# Altium schematic sheet T-FC10W-M.SchDoc
size A4; PageSetup: Record=PageOptions|CenterHorizontal=True|CenterVertical=True|PrintScale=0.97|XCorrection=1.00|YCorrection=1.00|PrintKind=0|BorderSize=5000000|LeftOffset=0|BottomOffset=0|Orientation=2|PaperLength=1000|PaperWidth=1000|Scale=100|PaperSource=7|PrintQuality=-3|MediaType=1|DitherType=10|PrintScaleMode=1|PaperKind=A4|PaperIndex=9
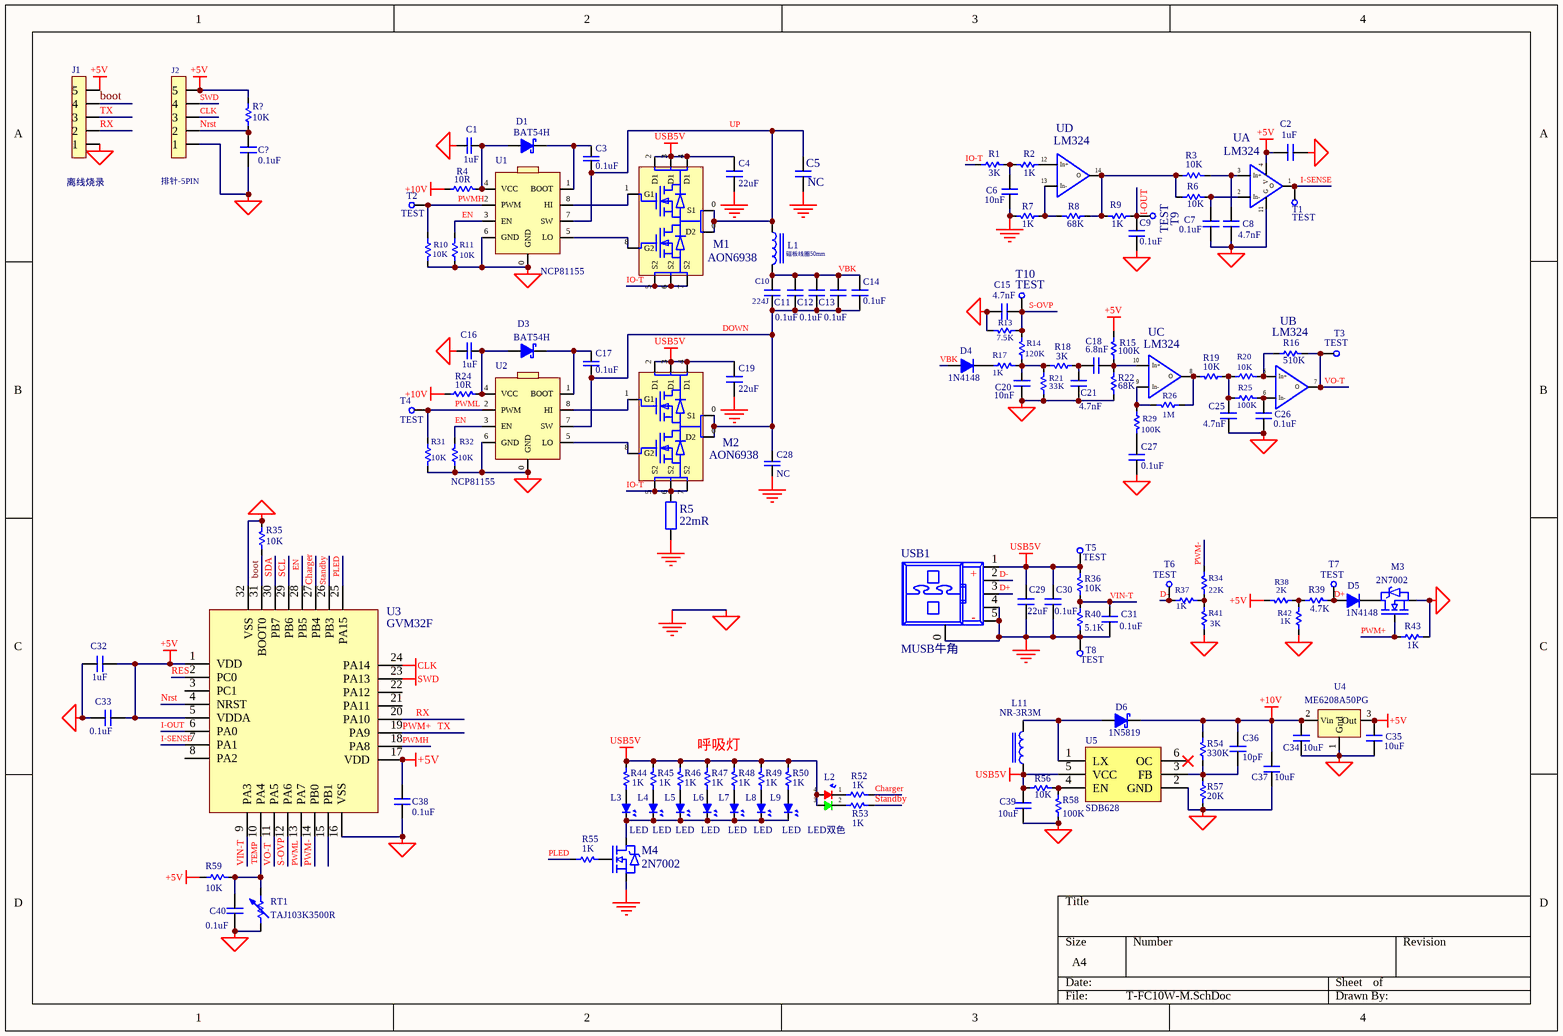
[diagram p0: T-FC10W-M.SchDoc]

## Parts
C1  C0603  [0603]  (value not drawn)
C2  1uF  [0603]
C3  C0603  [0603]  (value not drawn)
C4  22uF  [1206]
C5  NC  [0603]
C6  10nF  [0603]
C7  0.1uF  [0603]
C8  4.7nF  [0603]
C9  0.1uF  [0603]
C10  224J  [薄膜电容A]
C11  0.1uF  [1206]
C12  0.1uF  [1206]
C13  0.1uF  [1206]
C14  0.1uF  [1206]
C15  4.7nF  [0603]
C16  C0603  [0603]  (value not drawn)
C17  C0603  [0603]  (value not drawn)
C18  6.8nF  [0603]
C19  22uF  [1206]
C20  10nF  [0603]
C21  4.7nF  [0603]
C25  4.7nF  [0603]
C26  0.1uF  [0603]
C27  0.1uF  [0603]
C28  C0603  [0603]  (value not drawn)
C29  22uF  [1206]
C30  0.1uF  [0603]
C31  0.1uF  [0603]
C32  1uF  [0603]
C33  0.1uF  [0603]
C34  10uF  [0805]
C35  10uF  [0805]
C36  10pF  [0603]
C37  10uF  [0805]
C38  0.1uF  [0603]
C39  10uF  [0805]
C40  0.1uF  [0603]
C?  0.1uF  [0603]
D1  SOD-323  [SOD-323]  (value not drawn)
D3  SOD-323  [SOD-323]  (value not drawn)
D4  1N4148  [SOD-323]
D5  1N4148  [SOD-323]
D6  1N5819  [SOD-123]
J1  离线烧录  [5PIN排针1.25mm]
J2  排针-5PIN  [5PIN排针1.25mm]
L1  无线磁板线圈50mm  [磁板线圈50mm]  (value not drawn)
L2  LED双色  [LED0603双色]
L3  LED  [LED0802]
L4  LED  [LED0802]
L5  LED  [LED0802]
L6  LED  [LED0802]
L7  LED  [LED0802]
L8  LED  [LED0802]
L9  LED  [LED0802]
L11  NR-3R3M  [L3015T]
M1  AON6938  [QFN-5*6]
M2  AON6938  [QFN-5*6]
M3  2N7002  [SOT-23-L]
M4  2N7002  [SOT-23-L]
R1  3K  [0603]
R2  1K  [0603]
R3  10K  [0603]
R4  R0603  [0603]  (value not drawn)
R5  22mR  [1206]
R6  10K  [0603]
R7  1K  [0603]
R8  68K  [0603]
R9  1K  [0603]
R10  10K  [0603]
R11  10K  [0603]
R13  7.5K  [0603]
R14  120K  [0603]
R15  100K  [0603]
R16  510K  [0603]
R17  1K  [0603]
R18  3K  [0603]
R19  10K  [0603]
R20  10K  [0603]
R21  33K  [0603]
R22  68K  [0603]
R24  R0603  [0603]  (value not drawn)
R25  100K  [0603]
R26  1M  [0603]
R29  100K  [0603]
R31  10K  [0603]
R32  10K  [0603]
R34  22K  [0603]
R35  10K  [0603]
R36  10K  [0603]
R37  1K  [0603]
R38  2K  [0603]
R39  4.7K  [0603]
R40  5.1K  [0603]
R41  3K  [0603]
R42  1K  [0603]
R43  1K  [0603]
R44  1K  [0603]
R45  1K  [0603]
R46  1K  [0603]
R47  1K  [0603]
R48  1K  [0603]
R49  1K  [0603]
R50  1K  [0603]
R52  1K  [0603]
R53  1K  [0603]
R54  330K  [0603]
R55  1K  [0603]
R56  10K  [0603]
R57  20K  [0603]
R58  100K  [0603]
R59  10K  [0603]
R?  10K  [0603]
RT1  TAJ103K3500R  [0603]
T1  TEST  [测试点]
T2  TEST  [测试点]
T3  TEST  [测试点]
T4  TEST  [测试点]
T5  TEST  [测试点]
T6  TEST  [测试点]
T7  TEST  [测试点]
T8  TEST  [测试点]
T9  TEST  [测试点]
T10  TEST  [测试点]
U  LM324  [SOP-14]  (parts A,B,C,D of 4)
U1  NCP81155  [QFN-3*3-1]
U2  NCP81155  [QFN-3*3-1]
U3  GVM32F  [QFN-32PIN]
U4  ME6208A50PG  [SOT-89]
U5  SDB628  [SOT-23-6]
USB1  MUSB牛角  [MICRO-USB牛角]

## Nets
+5V: C2.2 C32.1 C33.1 C35.2 C38.1 J1.5 J2.5 R15.2 R38.2 R59.1 R?.2 U.4(V) U3.1(VDD) U3.5(VDDA) U3.17(VDD) U4.3(Out)
+10V: C34.2 C36.2 C37.2 D6.2(K) R4.1 R24.1 R54.2 U4.2(Vin)
CLK: J2.3 U3.24(PA14)
GND: C1.2 C2.1 C4.1 C5.1 C6.1 C7.1 C8.1 C9.2 C15.2 C16.2 C19.1 C20.1 C21.1 C25.1 C26.1 C27.2 C28.1 C29.1 C30.1 C31.1 C32.2 C33.2 C34.1 C35.1 C37.1 C38.2 C39.1 C40.1 C?.2 J1.1 J2.1 M3.3(S) M4.3(S) R5.1 R7.2 R10.2 R11.1 R13.2 R21.1 R22.1 R31.2 R32.1 R35.2 R40.1 R41.1 R42.1 R43.2 R57.2 R58.1 RT1.1 T8.1 U.11(G) U1.0(GND) U1.6(GND) U2.0(GND) U2.6(GND) U3.16(VSS) U3.32(VSS) U4.1(Gnd) U5.2(GND) USB1.0 USB1.4 USB1.5
SWD: J2.4 U3.23(PA13)
USB5V: C4.2 C19.2 C29.2 C30.2 C39.2 L2.3(A) L2.4(A) L11.1 M1.2(D1) M1.3(D1) M1.4(D1) M2.2(D1) M2.3(D1) M2.4(D1) R36.2 R44.2 R45.2 R46.2 R47.2 R48.2 R49.2 R50.2 R56.1 T5.1 U5.5(VCC) USB1.1
boot: J1.4 R35.1 U3.31(BOOT0)
Charger: R52.2 U3.27(PB4)
D+: D5.1 R39.2 T7.1 USB1.3
D-: R37.1 T6.1 USB1.2
DOWN: C10.1 C11.1 C12.1 C13.1 C14.1 C17.1 C28.2 M2.0(D2) U2.7(SW)
EN: R11.2 R32.2 U1.3(EN) U2.3(EN) U3.28(PB5)
I-OUT: C9.1 R9.1 T9.1 U3.6(PA0)
I-SENSE: T1.1 U.1(O) U3.7(PA1)
IO-T: M1.5(S2) M1.6(S2) M1.7(S2) M2.5(S2) M2.6(S2) M2.7(S2) R1.1 R5.2
Nrst: C?.1 J2.2 R?.1 U3.4(NRST)
PLED: R55.1 U3.25(PA15)
PWM+: J1.3 M3.1(G) R43.1 U3.19(PA9)  [also labelled TX]
PWM-: R34.2 U3.14(PB0)
PWMH: R10.1 T2.1 U1.2(PWM) U3.18(PA8)
PWML: R31.1 T4.1 U2.2(PWM) U3.13(PA7)
RES: U3.2(PC0)
RX: J1.2 U3.20(PA10)
S-OVP: C15.1 R13.1 R14.2 T10.1 U3.12(PA6)
SCL: U3.29(PB6)
SDA: U3.30(PB7)
Standby: R53.2 U3.26(PB3)
TEMP: C40.2 R59.2 RT1.2 U3.10(PA4)
UP: C3.1 C5.2 L1.1 M1.0(D2) U1.7(SW)
VBK: C10.2 C11.2 C12.2 C13.2 C14.2 D4.1 L1.2
VIN-T: C31.2 R36.1 R40.2 U3.9(PA3)
VO-T: R16.2 T3.1 U.7(O) U3.11(PA5)
NetC1_1: C1.1 D1.1(A) R4.2 U1.4(VCC)
NetC3_2: C3.2 D1.2(K) U1.1(BOOT)
NetC6_2: C6.2 R1.2 R2.2
NetC7_2: C7.2 R6.2 U.2(In-)
NetC8_2: C8.2 R3.2 U.3(In+)
NetC16_1: C16.1 D3.1(A) R24.2 U2.4(VCC)
NetC17_2: C17.2 D3.2(K) U2.1(BOOT)
NetC18_1: C18.1 C21.2 R18.1
NetC18_2: C18.2 R15.1 R22.2 U.10(In+)
NetC20_2: C20.2 R14.1 R17.2 R18.2 R21.2
NetC25_2: C25.2 R19.1 R20.1 R25.1
NetC26_2: C26.2 R25.2 U.6(In-)
NetC27_1: C27.1 R29.2
NetC36_1: C36.1 R54.1 R57.1 U5.3(FB)
NetD4_2: D4.2 R17.1
NetD5_2: D5.2 M3.2(D)
NetD6_1: D6.1(A) L11.2 U5.1(LX)
NetL2_1: L2.1(R) R52.1
NetL2_2: L2.2(G) R53.1
NetL3_1: L3.1(A) R44.1
NetL3_2: L3.2(K) L4.2(K) L5.2(K) L6.2(K) L7.2(K) L8.2(K) L9.2(K) M4.2(D)
NetL4_1: L4.1(A) R45.1
NetL5_1: L5.1(A) R46.1
NetL6_1: L6.1(A) R47.1
NetL7_1: L7.1(A) R48.1
NetL8_1: L8.1(A) R49.1
NetL9_1: L9.1(A) R50.1
NetM1_1: M1.1(G1) U1.8(HI)
NetM1_8: M1.8(G2) U1.5(LO)
NetM2_1: M2.1(G1) U2.8(HI)
NetM2_8: M2.8(G2) U2.5(LO)
NetM4_1: M4.1(G) R55.2
NetR2_1: R2.1 U.12(In+)
NetR3_1: R3.1 R6.1 R8.1 R9.2 U.14(O)
NetR7_1: R7.1 R8.2 U.13(In-)
NetR16_1: R16.1 R20.2 U.5(In+)
NetR19_2: R19.2 R26.1 U.8(O)
NetR26_2: R26.2 R29.1 U.9(In-)
NetR34_1: R34.1 R37.2 R41.2
NetR38_1: R38.1 R39.1 R42.2
NetR56_2: R56.2 R58.2 U5.4(EN)

Not connected (* = marked no-connect by the designer): U3 3(PC1) 8(PA2) 15(PB1) 21(PA11) 22(PA12); U5 6(OC)*

## Notes on the sheet
- 呼吸灯
- (in symbol C0603) 0.1uF; 1uF; NC
- (in symbol MICRO-USB-牛角) +; -
- (in symbol R0603) 10R

## Library data of the parts
C1-C3 C5-C9 C15-C18 C20 C21 C25-C28 C30-C33 C36 C38 C40 C? = C0603: 16V
C4 C19 C29 = C1206A: 16V
C10 = 薄膜电容B
C11-C14 = C1206: NPO
C34 C35 C37 C39 = C0805: 16V
D1 D3 = DIODE-SOD323: BAT54H
D4 D5 = DIODE-SOD323A
D6 = DIODE-SOD123
J1 = 排针-5PIN
L1 = 无线磁板线圈50mm: 磁板线圈50mm
L2 = LED0603双色
L3-L9 = LED0802: LED0802侧发光
L11 = L3015
M1 M2 = MOS-双N-DFN56: MOS双N
M3 M4 = MOS-N-SOT23A
R1 R4 R9-R11 R16 R18 R19 R24 R31 R32 R35 R37 R39 R43-R50 R52 R53 R55 R56 R58 R59 R? = R0603: 5%
R2 R3 R6-R8 R13-R15 R17 R20-R22 R25 R26 R29 R34 R36 R38 R40-R42 R54 R57 = R0603A: 1%
R5 = R1206: 5%
RT1 = R0603-ADJ: 5%
T1-T10 = TEST-PIONT
U = IC-SOP-14
U1 U2 = IC-QFN33
U3 = IC-QFN32PA
U4 = LDO-SOT89
U5 = IC-SOT23-6
USB1 = MICRO-USB-牛角